# Altium schematic sheet m451.SchDoc
size A4
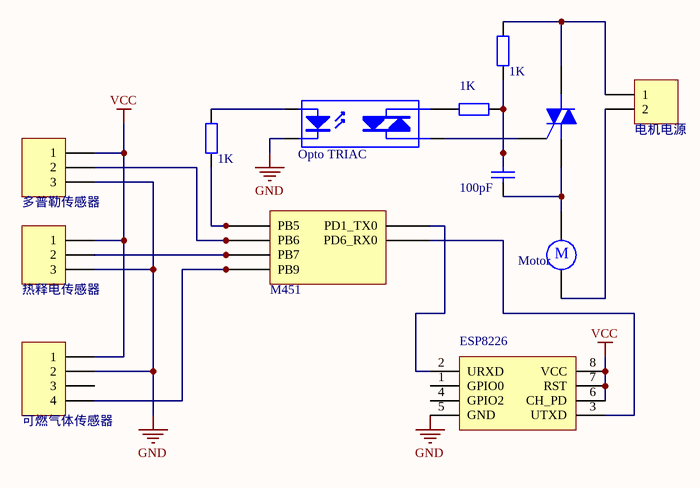
[diagram p0: m451.SchDoc]

## Parts
(Parts that share a designator on the sheet are numbered #1, #2 ... from top to bottom, then left to right.)
*  M451
B?  Motor  [RB5-10.5]
C?  value 100pF  [RAD-0.3]  (hidden comment: Cap)
ESP8226  6N136  [DIP-8N]  (value not drawn)
P?#1  电机电源  [HDR1X2]
P?#2  多普勒传感器  [HDR1X3H]
P?#3  热释电传感器  [HDR1X3H]
P?#4  可燃气体传感器  [HDR1X4]
Q?  Triac  [369-03]  (value not drawn)
R?#1  value 1K  [AXIAL-0.4]  (hidden comment: Res2)
R?#2  value 1K  [AXIAL-0.4]  (hidden comment: Res2)
R?#3  value 1K  [AXIAL-0.4]  (hidden comment: Res2)
U?  Opto TRIAC  [NPSIP4A]

## Nets
GND: ESP8226.5(GND) P?#2.3 P?#3.3 P?#4.2 U?.2(K)
VCC: ESP8226.6(CH_PD) ESP8226.7(RST) ESP8226.8(VCC) P?#2.1 P?#3.1 P?#4.1
Net*_0: *.0(PB5) R?#3.1
Net*_1: *.1(PB6) P?#2.2
Net*_2: *.2(PB7) P?#3.2
Net*_3: *.3(PB9) P?#4.4
Net*_4: *.4(PD1_TX0) ESP8226.2(URXD)
Net*_5: *.5(PD6_RX0) ESP8226.3(UTXD)
NetB?_1: B?.1 C?.1 Q?.1(M1)
NetB?_2: B?.2 P?#1.2
NetC?_2: C?.2 R?#1.1 R?#2.1
NetP?#1_1: P?#1.1 Q?.2(M2) R?#1.2
NetQ?_3: Q?.3(G) U?.4(A/K)
NetR?#2_2: R?#2.2 U?.3(A/K)
NetR?#3_2: R?#3.2 U?.1(A)

Not connected (* = marked no-connect by the designer): ESP8226 1(GPIO0) 4(GPIO2); P?#4 3

## Notes on the sheet
- (in symbol Motor) M

## Library data of the parts
* = Component_1
B? = Motor: Motor, General Kind; Published: 24-Mar-1999; LatestRevisionDate: 17-Jul-2002; LatestRevisionNote: Re-released for DXP Platform.; PackageReference: RB5-10.5; Publisher: Altium Limited
C? = Cap: Capacitor; Published: 8-Jun-2000; LatestRevisionDate: 17-Jul-2002; LatestRevisionNote: Re-released for DXP Platform.; PackageReference: RAD-0.3; Publisher: Altium Limited
ESP8226 = 6N136: 光耦
P?#1 = Header 2: Header, 2-Pin; LatestRevisionDate: 17-Jul-2002; LatestRevisionNote: Re-released for DXP Platform.; Publisher: Altium Limited
P?#2 P?#3 = Header 3H: Header, 3-Pin, Right Angle; LatestRevisionDate: 17-Jul-2002; LatestRevisionNote: Re-released for DXP Platform.; Publisher: Altium Limited
P?#4 = Header 4: Header, 4-Pin; LatestRevisionDate: 17-Jul-2002; LatestRevisionNote: Re-released for DXP Platform.; Publisher: Altium Limited
Q? = Triac: Silicon Bidirectional Triode Thyristor; Note: Pin 2 is electrically connected to Pin 4 (TAB); Published: 29-Sep-2000; LatestRevisionDate: 17-Jul-2002; LatestRevisionNote: Re-released for DXP Platform.; DatasheetDocument: 1999; PackageReference: 369-03; Publisher: Altium Limited; Code_JEDEC: TO-251-AA; ComponentLink1Description: Manufacturer Link; ComponentLink1URL: http://www.motorola.com/
R?#1-R?#3 = Res2: Resistor; Published: 8-Jun-2000; LatestRevisionDate: 17-Jul-2002; LatestRevisionNote: Re-released for DXP Platform.; PackageReference: AXIAL-0.4; Publisher: Altium Limited
U? = Opto TRIAC: Opto-Triac; Published: 24-Mar-1999; LatestRevisionDate: 17-Jul-2002; LatestRevisionNote: Re-released for DXP Platform.; PackageReference: NPSIP4A; Publisher: Altium Limited